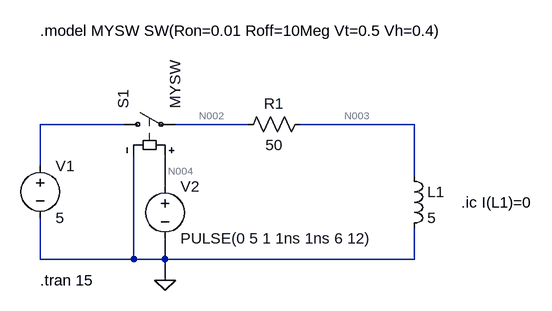
[diagram p0: schematic Transient_LC.asc]
Transient_LC.asc, the LTspice schematic file:
Version 4
SHEET 1 880 680
WIRE 64 64 -64 64
WIRE 256 64 144 64
WIRE 512 64 336 64
WIRE -64 128 -64 64
WIRE 512 144 512 64
WIRE 128 160 128 112
WIRE -64 272 -64 208
WIRE 80 272 80 112
WIRE 80 272 -64 272
WIRE 128 272 128 240
WIRE 128 272 80 272
WIRE 512 272 512 224
WIRE 512 272 128 272
WIRE 128 304 128 272
FLAG 128 304 0
SYMBOL res 240 80 R270
WINDOW 0 32 56 VTop 2
WINDOW 3 0 56 VBottom 2
SYMATTR InstName R1
SYMATTR Value 50
SYMBOL ind 496 128 R0
SYMATTR InstName L1
SYMATTR Value 5
SYMBOL voltage -64 112 R0
SYMATTR InstName V1
SYMATTR Value 5
SYMBOL sw 48 64 R270
SYMATTR InstName S1
SYMATTR Value MYSW
SYMBOL voltage 128 144 R0
WINDOW 123 0 0 Left 0
WINDOW 39 0 0 Left 0
SYMATTR InstName V2
SYMATTR Value PULSE(0 5 1 1ns 1ns 6 12)
TEXT -64 -80 Left 2 !.model MYSW SW(Ron=0.01 Roff=10Meg Vt=0.5 Vh=0.4)
TEXT -64 304 Left 2 !.tran 15
TEXT 584 184 Left 2 !.ic I(L1)=0

The netlist it stands for:
* Transient_LC.asc
R1 N002 N003 50
L1 N003 0 5
V1 N001 0 5
S1 N001 N002 N004 0 MYSW
V2 N004 0 PULSE(0 5 1 1ns 1ns 6 12)
.model MYSW SW(Ron=0.01 Roff=10Meg Vt=0.5 Vh=0.4)
.tran 15
.ic I(L1)=0
.backanno
.end

* Results of the author's LTspice run, read from the files saved beside the schematic
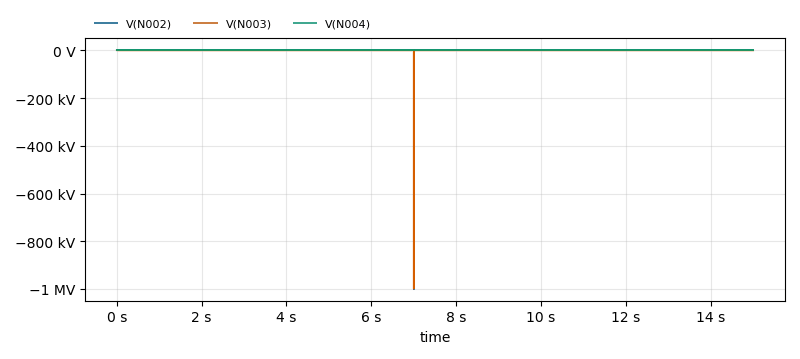
[diagram p1: Transient Analysis of Transient_LC.asc, plotted from the saved traces]
* Transient Analysis, 1 run:
*   V(N002): min -999.5 kV, max 5 V, average 2.632 V, rms 132.6 V, last 4.999 V
*   V(N003): min -999.5 kV, max 5 V, average 0 V, rms 132.5 V, last 0 V
*   V(N004): min 0 V, max 5 V, average 2.667 V, rms 3.651 V, last 5 V